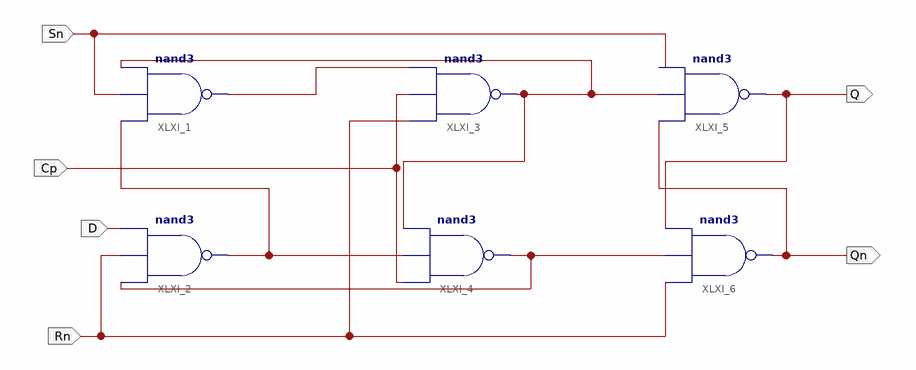
[diagram p0: schematic sheet 1]
// Xilinx ISE schematic MB_DFF.sch (kintex7) as structural Verilog: 6 symbols, 6 ports
module MB_DFF (
  input  Cp,
  input  Rn,
  input  D,
  input  Sn,
  output Q,
  output Qn
);

  wire XLXN_3, XLXN_5, XLXN_12, XLXN_19;

  nand XLXI_1 (XLXN_3, XLXN_5, Sn, XLXN_19);
  nand XLXI_2 (XLXN_5, XLXN_12, Rn, D);
  nand XLXI_3 (XLXN_19, Rn, Cp, XLXN_3);
  nand XLXI_4 (XLXN_12, Cp, XLXN_5, XLXN_19);
  nand XLXI_5 (Q, Qn, XLXN_19, Sn);
  nand XLXI_6 (Qn, Rn, XLXN_12, Q);
endmodule
